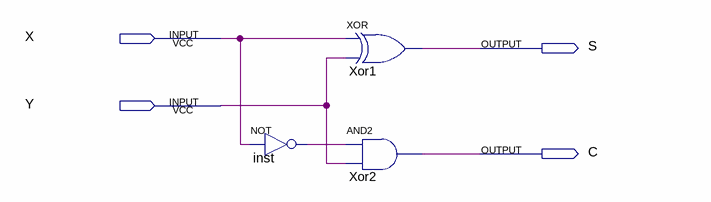
[diagram p0: schematic sheet]
// Quartus schematic half_deadd.bdf as structural Verilog: 3 symbols, 4 pins
module half_deadd (
  input  X,
  input  Y,
  output S,
  output C
);

  wire inst_out;

  not inst (inst_out, X);
  xor Xor1 (S, X, Y);
  and Xor2 (C, inst_out, Y);
endmodule
